# EAGLE design Zio Qwiic Hub (EAGLE 8.4.1)
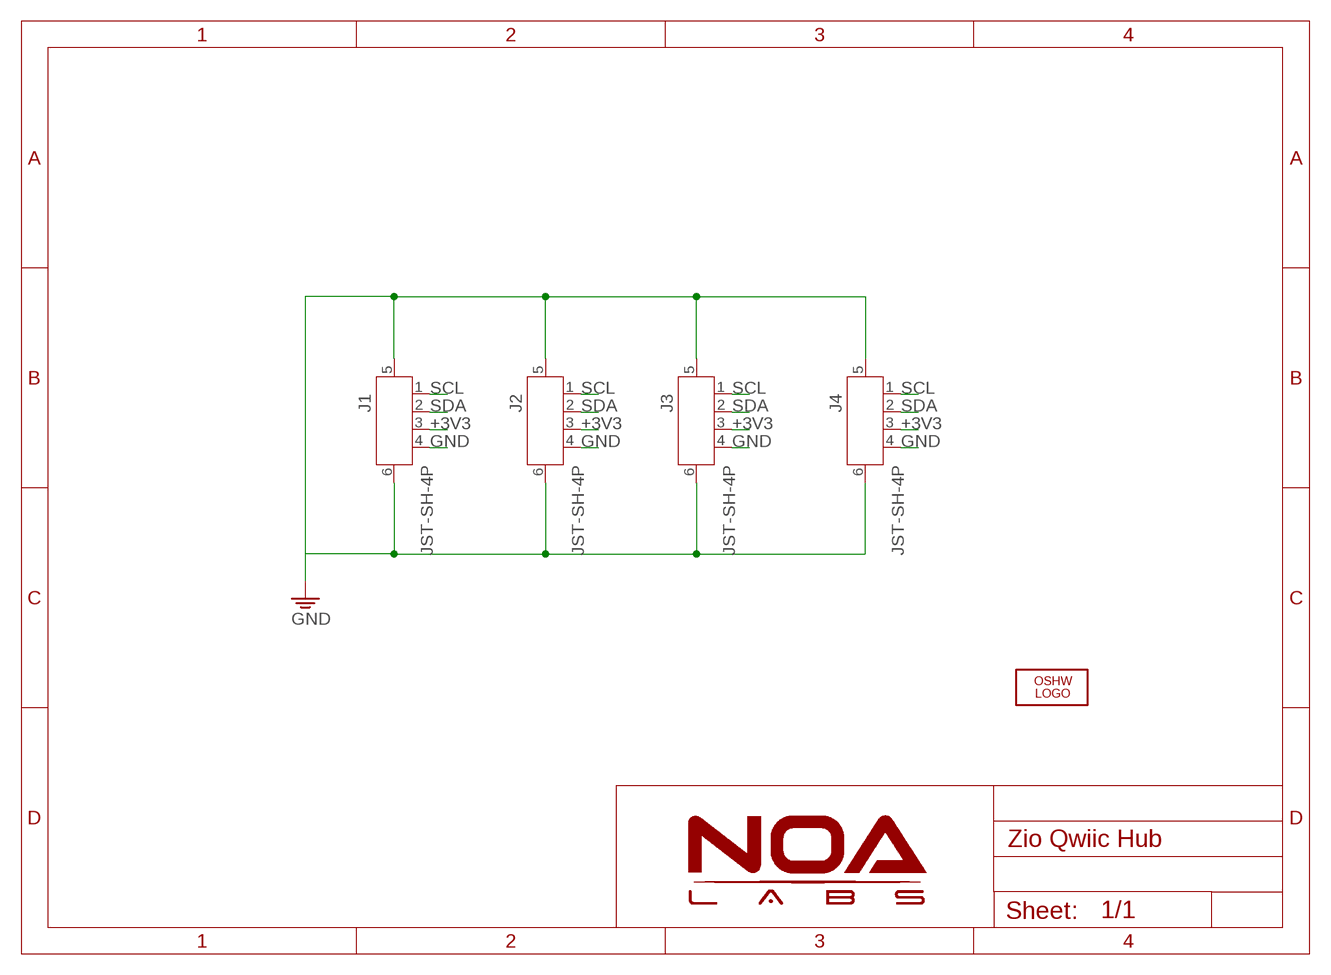
[diagram p0: schematic, sheet 1]

## Parts
J1  JST-SH-4P  [JST-SH-4P-90]
J2  JST-SH-4P  [JST-SH-4P-90]
J3  JST-SH-4P  [JST-SH-4P-90]
J4  JST-SH-4P  [JST-SH-4P-90]
LOGO1  LOGO-OSHW-6MILX0070-NT  [OSHW_6X70_NOTEXT]

## Nets
+3V3: J1.3 J2.3 J3.3 J4.3
GND: J1.4 J1.5 J1.6 J2.4 J2.5 J2.6 J3.4 J3.5 J3.6 J4.4 J4.5 J4.6
SCL: J1.1 J2.1 J3.1 J4.1
SDA: J1.2 J2.2 J3.2 J4.2

## Library data of the parts
J1-J4 = Connector:JST-SH-4P
LOGO1 = Logo:LOGO-OSHW-6MIL

## Board
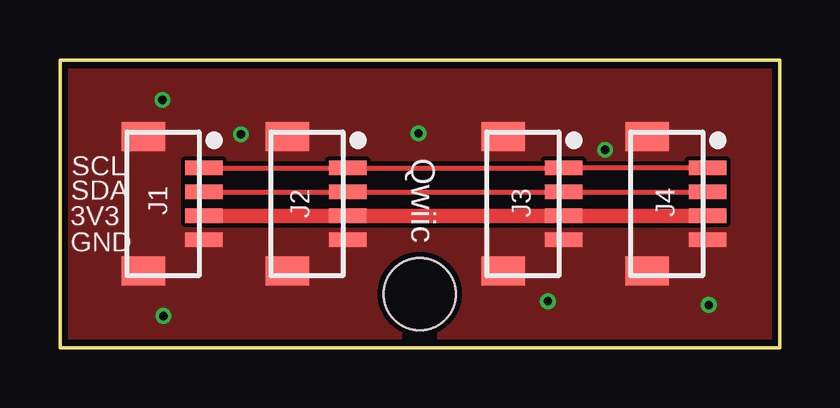
[diagram p1: board, top side]
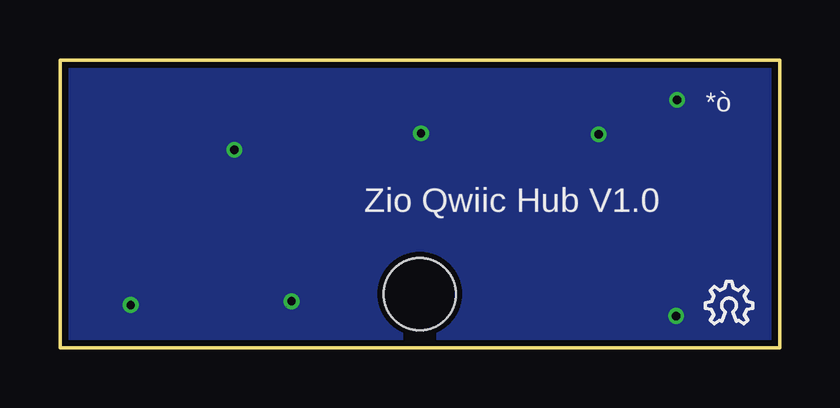
[diagram p2: board, bottom side, seen from below]

Size 30 x 12 mm. Coordinates in mm from the lower left corner, seen from the top.
Outline: 0,0 0,12 30,12 30,0 0,0
Copper layers (1*16): Top 0.035mm / dielectric 1.5mm / Bottom 0.035mm
Design rules "NOA Eagle Rule *": minimum track width 7mil, minimum drill 12mil, track to track 7mil, track to pad 7mil, pad to pad 7mil, via to via 7mil, smd to smd 0mil, copper to edge 10mil, drill to drill 10mil, minimum pad ring 10mil, minimum via ring 6mil, stop-mask expansion 2mil, vias tented up to drill 25mil, thermal gap 10mil
Holes 3 mm at 15,2.24

### Footprints (pad centres in the part's own frame; a part is rotated, then mirrored left to right if it is on the bottom)
JST-SH-4P-90 = smd 0.6 x 1.55: 1 1.5,0; 2 0.5,0; 3 -0.5,0; 4 -1.5,0 | smd 1.2 x 1.8: 5 -2.8,2.525; 6 2.8,2.525

### Placement (x,y rotation side)
E$10  [7MM]  13.06,7.19 0 bottom
J1  6,6 90 top
J2  12,6 90 top
J3  21,6 90 top
J4  27,6 90 top
LOGO1  3.1,0.98 0 bottom

### Tracks (layer width: path | path; a pad name or v marks a point on that pad's centre or on a via)
+3V3
  Top 0.61: J1.3 J2.3 J3.3 J4.3
GND  (via drill 0.35)
  other vias: 4.27,10.34 4.32,1.32 27.05,1.78 14.95,8.93 22.73,8.26 7.54,8.89 20.35,1.93
  pour Top (no thermals): 0,0 29.97,0 29.97,11.94 0,11.94 0,11.81
  pour Bottom: 0,0 30,0 30,12.01 0,12.01
SCL
  Top 0.203: J4.1 J3.1 J2.1 J1.1
SDA
  Top 0.203: J1.2 J2.2 J3.2 J4.2

### Text on the board
tPlace: Qwiic | SCL | SDA | 3V3 | GND
bPlace: *ò | Zio Qwiic Hub V1.0 | C:/Users/NOA-01/Documents/eagle/Eagle/ulp/logo/NOA Logo - for Screen - 1000x435 + White Background Mirror.bmp